# EAGLE design Thermocouple (EAGLE 7.4.0)
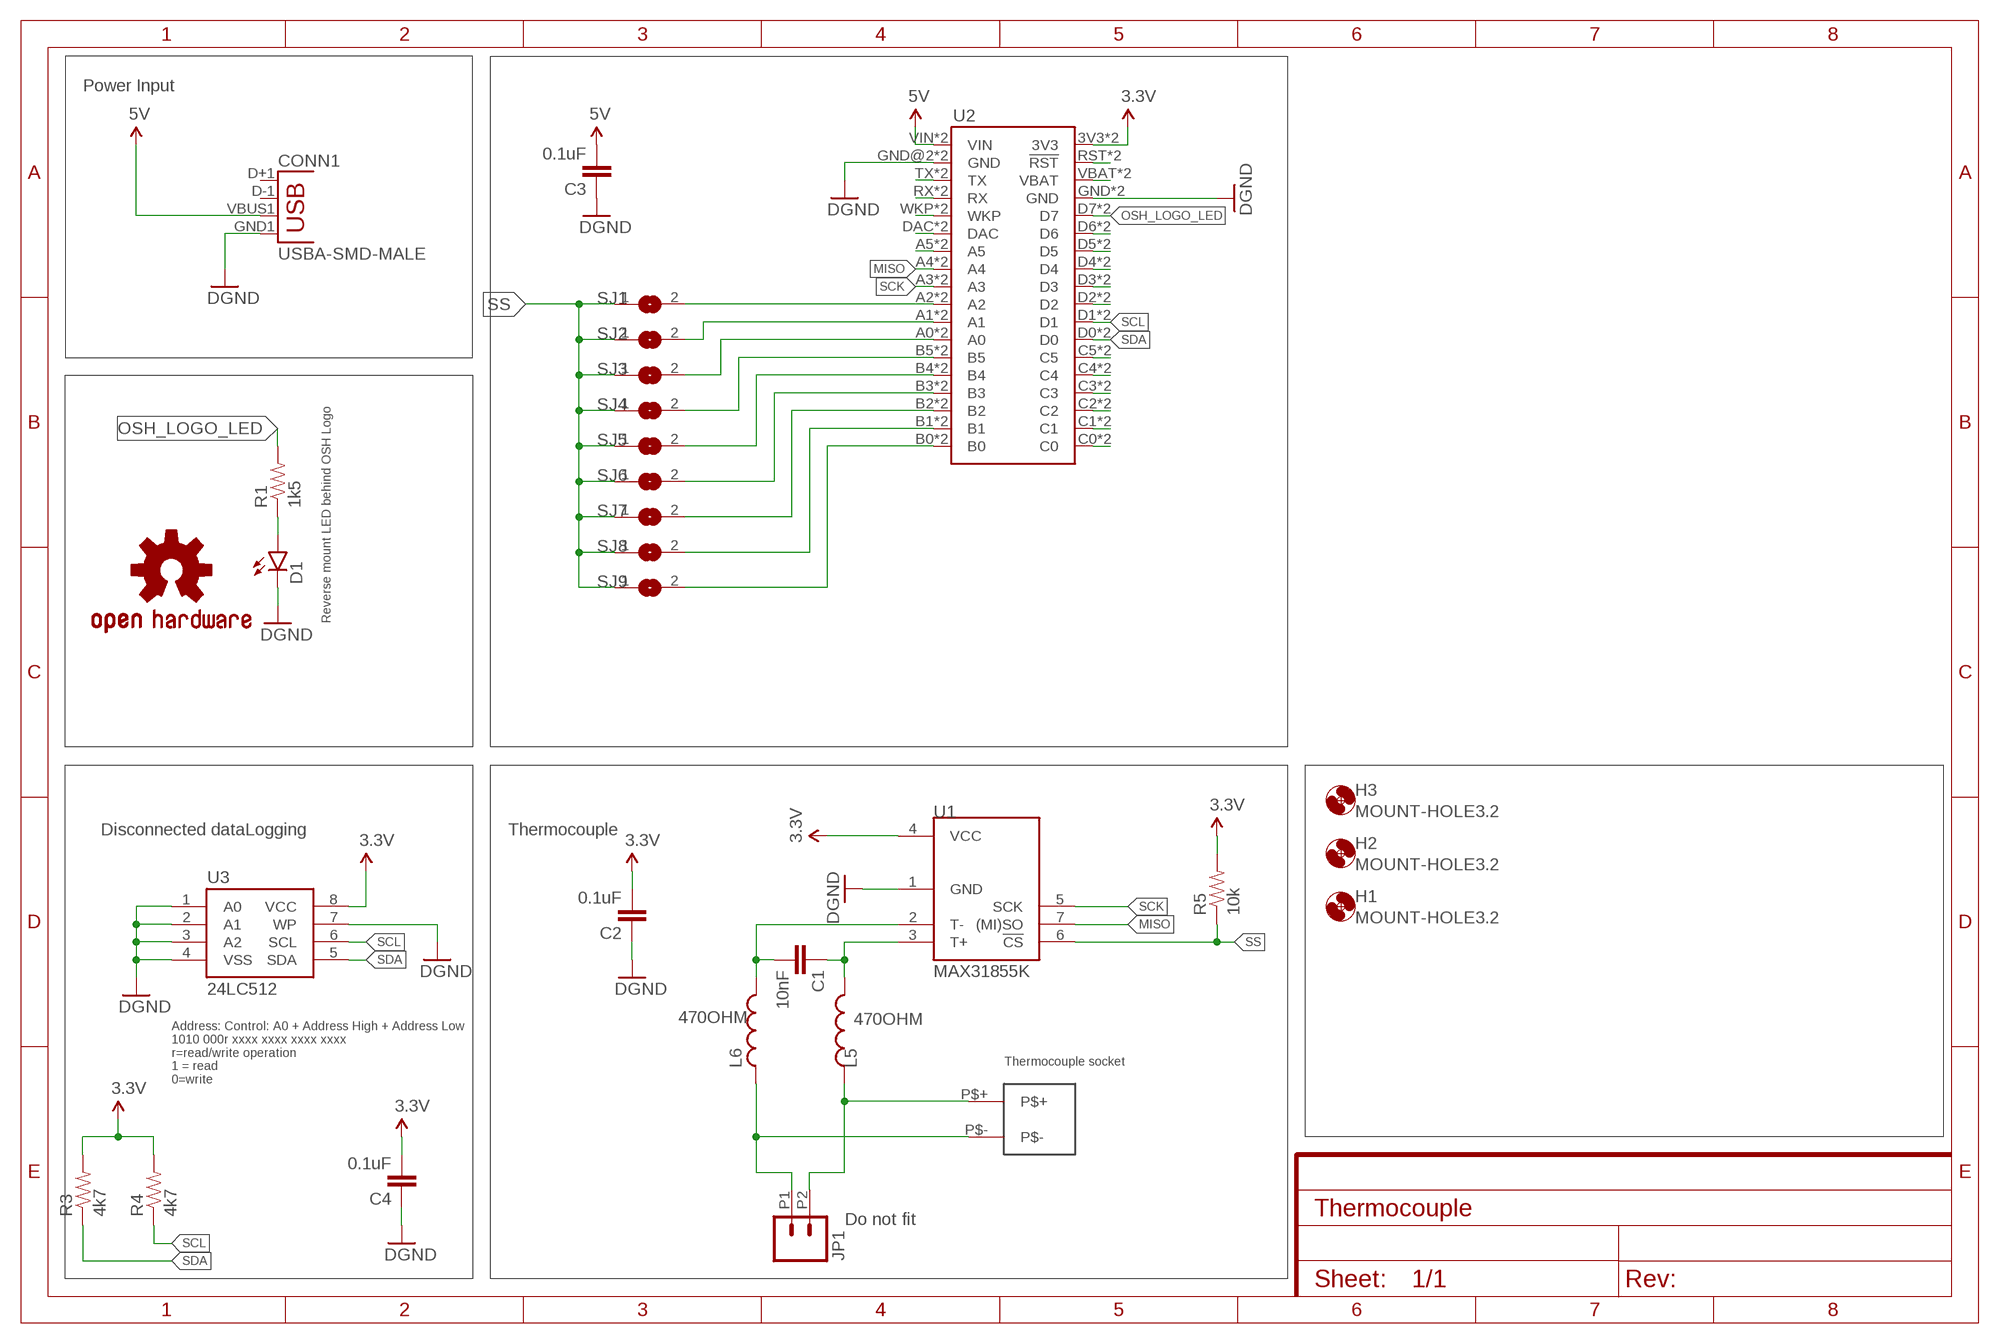
[diagram p0: schematic, sheet 1]

## Parts
C1  10nF  CAP0805  [0805]
C2  0.1uF  CAP0805  [0805]
C3  0.1uF  CAP0805  [0805]
C4  0.1uF  CAP0805  [0805]
CONN1  USBA-SMD-MALE  [USB-A-SMT-MALE]
D1  LED1206-BOTTOM  [LED-1206-BOTTOM]
H1  MOUNT-HOLE3.2  [3,2]
H2  MOUNT-HOLE3.2  [3,2]
H3  MOUNT-HOLE3.2  [3,2]
JP1  M022.54MM_SCREWTERM  [1X02_2.54_SCREWTERM]
JP2  THERMOCOUPLE_SOCKET_K-TYPE  [THERMOCOUPLE_SOCKET_K-TYPE]
L5  470OHM  INDUCTOR0805  [0805]
L6  470OHM  INDUCTOR0805  [0805]
LOGO1  OSHW-LOGOM  [OSHW-LOGO-M]
R1  1k5  RESISTOR1206  [1206]
R3  4k7  RESISTOR0805-RES  [0805]
R4  4k7  RESISTOR0805-RES  [0805]
R5  10k  RESISTOR0805-RES  [0805]
SJ1  SJ  [SJ]
SJ2  SJ  [SJ]
SJ3  SJ  [SJ]
SJ4  SJ  [SJ]
SJ5  SJ  [SJ]
SJ6  SJ  [SJ]
SJ7  SJ  [SJ]
SJ8  SJ  [SJ]
SJ9  SJ  [SJ]
U1  MAX31855K  [SOIC8]
U2  ELECTRONDUALNAMED  [ELECTRON_SIMPLE_SILK_NAMES_DUAL]
U3  24LC512  EEPROM-I2CSMD  [SO08]

## Nets
3.3V: C2.2 C4.2 R3.2 R4.2 R5.2 U1.4(VCC) U2.3V3 U2.3V3_1(3V3) U3.8(VCC)
5V: C3.2 CONN1.VBUS1(VBUS) U2.VIN U2.VIN_1B(VIN)
DQ: SJ3.2 U2.A0 U2.A0_1(A0)
GND: C2.1 C3.1 C4.1 CONN1.GND1(GND) D1.C U1.1(GND) U2.GND U2.GND@2(GND) U2.GND_1(GND) U2.GND_1B(GND) U3.1(A0) U3.2(A1) U3.3(A2) U3.4(VSS) U3.7(WP) ; supply symbol labelled DGND
MISO: U1.7((MI)SO) U2.A4 U2.A4_1(A4)
MOSI: U2.A5 U2.A5_1(A5)
N$3: SJ2.2 U2.A1 U2.A1_1(A1)
N$4: U2.D2 U2.D2_1(D2)
N$6: U2.VBAT U2.VBATT_1(VBAT)
N$7: U2.RST(!RST) U2.RST_1(!RST)
N$11: C1.2 L6.2 U1.2(T-)
N$12: U2.D3 U2.D3_1(D3)
N$13: C1.1 L5.2 U1.3(T+)
N$15: U2.D6 U2.D6_1(D6)
N$16: U2.D5 U2.D5_1(D5)
N$19: JP1.P1 JP2.P$- L6.1
N$20: JP1.P2 JP2.P$+ L5.1
N$21: D1.A R1.1
N$22: U2.C1 U2.C1_1(C1)
N$23: U2.C5 U2.C5_1(C5)
N$24: U2.C4 U2.C4_1(C4)
N$25: U2.C3 U2.C3_1(C3)
N$26: U2.C2 U2.C2_1(C2)
N$27: U2.C0 U2.C0_1(C0)
N$28: U2.D4 U2.D4_1(D4)
N$29: U2.DAC U2.DAC_1(DAC)
N$30: SJ1.2 U2.A2 U2.A2_1(A2)
N$31: SJ9.2 U2.B0 U2.B0_1(B0)
N$33: SJ8.2 U2.B1 U2.B1_1(B1)
N$35: SJ7.2 U2.B2 U2.B2_1(B2)
N$36: SJ6.2 U2.B3 U2.B3_1(B3)
N$37: SJ5.2 U2.B4 U2.B4_1(B4)
N$38: SJ4.2 U2.B5 U2.B5_1(B5)
N$46: U2.WKP U2.WKP_1(WKP)
N$47: U2.RX U2.RX_1(RX)
N$48: U2.TX U2.TX_1(TX)
OSH_LOGO_LED: R1.2 U2.D7 U2.D7_1(D7)
SCK: U1.5(SCK) U2.A3 U2.A3_1(A3)
SCL: R4.1 U2.D1 U2.D1_1(D1) U3.6(SCL)
SDA: R3.1 U2.D0 U2.D0_1(D0) U3.5(SDA)
SS: R5.1 SJ1.1 SJ2.1 SJ3.1 SJ4.1 SJ5.1 SJ6.1 SJ7.1 SJ8.1 SJ9.1 U1.6(!CS)
Unconnected: CONN1.D+1(D+) CONN1.D-1(D-)

## Notes on the sheet
- Power Input
- Reverse mount LED behind OSH Logo
- Disconnected dataLogging | Thermocouple
- Address: Control: A0 + Address High + Address Low
- Thermocouple socket
- 1010 000r xxxx xxxx xxxx xxxx
  r=read/write operation
  1 = read
  0=write
- Do not fit

## Library data of the parts
C1 = SparkFun-Capacitors:CAP: Capacitor Standard 0603 ceramic capacitor, and 0.1" leaded capacitor.
C2-C4 = SparkFun-Passives:CAP: Capacitor Standard 0603 ceramic capacitor, and 0.1" leaded capacitor.
CONN1 = SparkFun-Connectors:USB: USB Connectors USB-B-PTH is fully proven SKU : PRT-00139/CONN-08278 USB-miniB is fully proven SKU : PRT-00587 USB-A-PCB is untested. USB-A-H is throughly reviewed, but untested. Spark Fun Electronics SKU : PRT-00437 USB-B-SMT is throughly reviewed, but untested. Needs silkscreen touching up. USB-A-S has not been used/tested USB-MB-H has not been used/tested USB-MICROB has been used. CONN-09505
D1 = SparkFun-LED:LED: LEDs Standard schematic elements and footprints for 5mm, 3mm, 1206, and 0603 sized LEDs. 5mm - Spark Fun Electronics SKU : COM-00529 (and others)
H1-H3 = holes:MOUNT-HOLE: MOUNTING HOLE with drill center marker
JP1 = SparkFun-Connectors:M02: Standard 2-pin 0.1" header. Use with - straight break away headers ( PRT-00116) - right angle break away headers (PRT-00553) - swiss pins (PRT-00743) - machine pins (PRT-00117) - female headers (PRT-00115) Molex polarized connector foot print use with: PRT-08233 with associated crimp pins and housings. 2.54_SCREWTERM for use with PRT-10571. 3.5mm Screw Terminal footprints for PRT-08084 5mm Screw Terminal footprints for use with PRT-08432
JP2 = Tinamous:THERMOCOUPLE_SOCKET_K-TYPE
L5 L6 = SparkFun-Passives:INDUCTOR: Inductors Basic Inductor/Choke - 0603 and 1206. Footprints are not proven and vary greatly between part numbers. INDUCTOR POWER 3.3UH 4.0A SMD 0.197" L x 0.197" W x 0.177" H (5.00mm x 5.00mm x 4.50mm); FARNELL: 1669726
LOGO1 = SparkFun-Aesthetics:OSHW-LOGO: Open Source Hardware Logo This logo indicates the piece of hardware it is found on incorporates a OSHW license and/or adheres to the definition of open source hardware found here: http://freedomdefined.org/OSHW
R1 R3-R5 = SparkFun-Resistors:RESISTOR: Resistor Basic schematic elements and footprints for 0603, 1206, and PTH resistors.
SJ1-SJ9 = jumper:SJ: SMD solder JUMPER
U1 = SparkFun-AnalogIC:MAX31855K: Cold-Junction-Compensated K-Thermocoupleto-Digital Converter (-270°C to +1800°C) The MAX31855K performs cold-junction compensation and digitizes the signal from a type-K thermocouple. The data is output in a 14-bit resolution, SPI™-compatible, read-only format. This converter resolves temperatures to 0.25°C, allows readings as high as +1800°C and as low as -270°C, and exhibits thermocouple accuracy of ±2°C for temperatures ranging from -200°C to +700°C for K-type thermocouples.
U2 = Tinamous:ELECTRON
U3 = SparkFun-DigitalIC:EEPROM-I2C: I2C EEPROM chips, 24LC256 (and others); FARNELL: 1801220

## Board
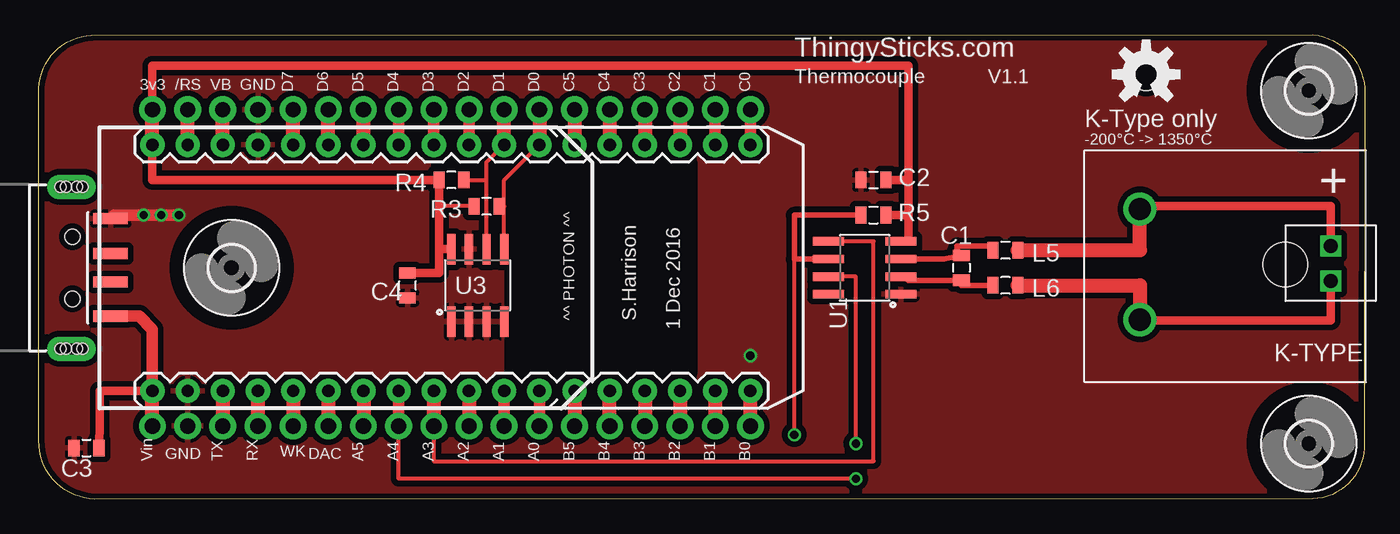
[diagram p1: board, top side]
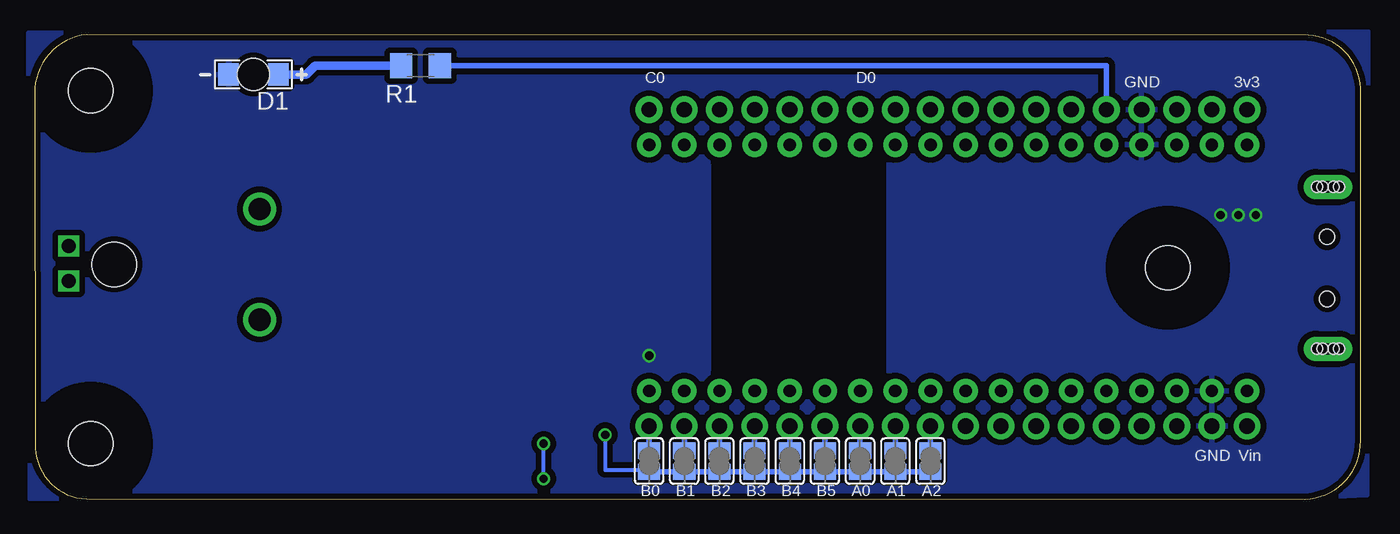
[diagram p2: board, bottom side, seen from below]

Size 95.75 x 33.56 mm. Coordinates in mm from the lower left corner, seen from the top.
Outline: 3.77,33.52 92,33.56 arc-90 95.73,28.91 95.7,4.01 arc-90 92,0.01 4.02,0 arc-90 0,4.21 0,29.31 arc-90 3.77,33.52
Copper layers (1*16): Top 0.0356mm / dielectric 1.5011mm / Bottom 0.0356mm
Design rules "OSHPark": minimum track width 6mil, minimum drill 13mil, track to track 6mil, track to pad 6mil, pad to pad 6mil, via to via 6mil, smd to smd 6mil, copper to edge 15mil, drill to drill 6mil, minimum pad ring 7mil, minimum via ring 7mil, stop-mask expansion 3mil, vias tented up to drill 0mil, thermal gap 10mil
tRestrict: area 34.2,6.5 to 46.9,26.9
bRestrict: area 34.9,6.5 to 46.3,26.9

### Footprints (pad centres in the part's own frame; a part is rotated, then mirrored left to right if it is on the bottom)
0805 = smd 0.8 x 1.2: 1 -0.9,0; 2 0.9,0
USB-A-SMT-MALE = smd 0.8 x 2.5: D+1 1.027,-5.87; D-1 -1.027,-5.87; GND1 3.551,-5.87; VBUS1 -3.5,-5.87 | drill 0.8 pad 1.778 long: P$1 5.85,-3.05; P$3 -5.85,-3.05 | hole 1.1: 2.25,-3.12; -2.25,-3.12 | hole 0.8: -5.85,-3.45; -5.85,-3.85; -5.85,-2.65; -5.85,-2.25; 5.85,-3.45; 5.85,-3.85; 5.85,-2.65; 5.85,-2.25
LED-1206-BOTTOM = smd 1.5 x 1.6: A -1.8,0; C 1.8,0 | hole 2.3: 0,0
3,2 = hole 3.2: 0,0
1X02_2.54_SCREWTERM = drill 1.016 square: P1 2.54,0; P2 0,0
THERMOCOUPLE_SOCKET_K-TYPE = drill 1.6: P$+ 4,12.5; P$- 4,4.5 | hole 3.2: 14.5,8.5
1206 = smd 1.6 x 1.8: 1 -1.4,0; 2 1.4,0
SJ = smd 1.168 x 1.6: 1 -0.762,0; 2 0.762,0
SOIC8 = smd 0.61 x 2.21: 1 -1.905,-2.616; 2 -0.635,-2.616; 3 0.635,-2.616; 4 1.905,-2.616; 5 1.905,2.616; 6 0.635,2.616; 7 -0.635,2.616; 8 -1.905,2.616
ELECTRON_SIMPLE_SILK_NAMES_DUAL = drill 0.889 pad 1.753: 3V3 1.27,22.86; A0 29.21,5.08; A1 26.67,5.08; A2 24.13,5.08; A3 21.59,5.08; A4 19.05,5.08; A5 16.51,5.08; B0 44.45,5.08; B1 41.91,5.08; B2 39.37,5.08; B3 36.83,5.08; B4 34.29,5.08; B5 31.75,5.08; C0 44.45,22.86; C1 41.91,22.86; C2 39.37,22.86; C3 36.83,22.86; C4 34.29,22.86; C5 31.75,22.86; D0 29.21,22.86; D1 26.67,22.86; D2 24.13,22.86; D3 21.59,22.86; D4 19.05,22.86; D5 16.51,22.86; D6 13.97,22.86; D7 11.43,22.86; DAC 13.97,5.08; GND 8.89,22.86; GND@2 3.81,5.08; RST 3.81,22.86; RX 8.89,5.08; TX 6.35,5.08; VBAT 6.35,22.86; VIN 1.27,5.08; WKP 11.43,5.08 | drill 1.1 pad 1.93: 3V3_1 1.27,25.4; A0_1 29.21,2.54; A1_1 26.67,2.54; A2_1 24.13,2.54; A3_1 21.59,2.54; A4_1 19.05,2.54; A5_1 16.51,2.54; B0_1 44.45,2.54; B1_1 41.91,2.54; B2_1 39.37,2.54; B3_1 36.83,2.54; B4_1 34.29,2.54; B5_1 31.75,2.54; C0_1 44.45,25.4; C1_1 41.91,25.4; C2_1 39.37,25.4; C3_1 36.83,25.4; C4_1 34.29,25.4; C5_1 31.75,25.4; D0_1 29.21,25.4; D1_1 26.67,25.4; D2_1 24.13,25.4; D3_1 21.59,25.4; D4_1 19.05,25.4; D5_1 16.51,25.4; D6_1 13.97,25.4; D7_1 11.43,25.4; DAC_1 13.97,2.54; GND_1 8.89,25.4; GND_1B 3.81,2.54; RST_1 3.81,25.4; RX_1 8.89,2.54; TX_1 6.35,2.54; VBATT_1 6.35,25.4; VIN_1B 1.27,2.54; WKP_1 11.43,2.54
SO08 = smd 0.61 x 2.21: 1 -1.905,-2.616; 2 -0.635,-2.616; 3 0.635,-2.616; 4 1.905,-2.616; 5 1.905,2.616; 6 0.635,2.616; 7 -0.635,2.616; 8 -1.905,2.616

### Placement (x,y rotation side)
C1  66.62,16.71 270 top
C2  60.27,23.06 0 top
C3  3.44,3.69 0 top
C4  26.61,15.44 90 top
CONN1  -0.69,16.71 90 top
D1  79.95,30.68 180 bottom
H1  13.91,16.71 0 top
H2  91.7,4.01 0 top
H3  91.7,29.51 0 top
JP1  93.29,18.3 270 top
JP2  75.51,8.46 0 top
L5  69.79,17.98 180 top
L6  69.79,15.44 180 top
LOGO1  79.95,30.68 0 top
R1  67.89,31.31 0 bottom
R3  32.33,21.16 180 top
R4  29.79,23.06 180 top
R5  60.27,20.52 0 top
SJ1  31.06,2.74 90 bottom
SJ2  33.6,2.74 90 bottom
SJ3  36.14,2.74 90 bottom
SJ4  38.68,2.74 90 bottom
SJ5  41.22,2.74 90 bottom
SJ6  43.76,2.74 90 bottom
SJ7  46.3,2.74 90 bottom
SJ8  48.84,2.74 90 bottom
SJ9  51.38,2.74 90 bottom
U1  59.63,16.71 90 top
U2  6.93,2.74 0 top
U3  31.69,15.44 0 top

### Tracks (layer width: path | path; a pad name or v marks a point on that pad's centre or on a via)
3.3V
  Top 0.305: R3.2 28.89,21.16 R4.2
  Top 0.61: U2.3V3 8.2,23.06 R4.2 28.89,18.06 | U3.8 28.89,18.06 | C4.2 28.89,16.34 28.89,18.06 | R5.2 62.81,20.52 | 62.81,20.52 62.81,23.06 | 62.81,23.06 62.81,31.31 8.2,31.31 U2.3V3_1 | C2.2 62.81,23.06 | U1.4 62.81,18.62 62.81,20.52
  Top 1.016: U2.3V3 U2.3V3_1
5V
  Top 0.61: C3.2 4.39,4.96 4.39,7.82 U2.VIN
  Top 0.813: U2.VIN_1B 8.2,12.27 7.25,13.22 CONN1.VBUS1
  Top 1.016: U2.VIN_1B U2.VIN
DQ
  Top 0.813: U2.A0_1 U2.A0
  Bottom 0.406: SJ3.2 U2.A0_1
GND  (via drill 0.6)
  Top 0.813: v10.1,20.52 5.44,20.52 CONN1.GND1
  other vias: 51.38,10.36 7.56,20.52 8.83,20.52
  pour Bottom (isolate 0.406, rank 6): -0.51,33.78 96.18,33.68 96.05,0.03 1.8,0.21 -0.46,0.31
  pour Top (isolate 0.406, rank 6): -0.69,35.12 96.46,34.49 96.78,-0.12 -0.69,0.2
MISO  (via drill 0.6)
  Top 0.305: U1.7 59,16.07 v59,4.01 | v59,1.47 25.98,1.47 U2.A4
  Top 0.813: U2.A4_1 U2.A4
  Bottom 0.305: v59,1.47 v59,4.01
MOSI
  Top 1.016: U2.A5 U2.A5_1
N$3
  Top 0.813: U2.A1_1 U2.A1
  Bottom 0.406: U2.A1_1 SJ2.2
N$4
  Top 0.813: U2.D2_1 U2.D2
N$6
  Top 1.016: U2.VBAT U2.VBATT_1
N$7
  Top 1.016: U2.RST U2.RST_1
N$11
  Top 0.406: L6.2 66.62,15.44 C1.2 62.81,15.81 U1.2
N$12
  Top 0.813: U2.D3_1 U2.D3
N$13
  Top 0.406: L5.2 68.89,18.3 66.3,18.3 66.3,17.98 C1.1 65.35,17.34 U1.3
N$15
  Top 1.016: U2.D6 U2.D6_1
N$16
  Top 1.016: U2.D5 U2.D5_1
N$19
  Top 0.61: JP1.P1 93.29,12.9 79.51,12.9 JP2.P$-
  Top 1.016: L6.1 79.51,15.44 JP2.P$-
N$20
  Top 0.61: JP1.P2 93.29,21.16 79.51,21.16 JP2.P$+
  Top 1.016: L5.1 79.51,17.98 JP2.P$+
N$21
  Bottom 0.61: R1.1 75.51,31.31 76.14,30.68 D1.A
N$22
  Top 0.813: U2.C1_1 U2.C1
N$23
  Top 1.016: U2.C5_1 U2.C5
N$24
  Top 1.016: U2.C4_1 U2.C4
N$25
  Top 1.016: U2.C3_1 U2.C3
N$26
  Top 1.016: U2.C2_1 U2.C2
N$27
  Top 0.813: U2.C0_1 U2.C0
N$28
  Top 0.813: U2.D4_1 U2.D4
N$29
  Top 1.016: U2.DAC U2.DAC_1
N$30
  Top 1.016: U2.A2 U2.A2_1
  Bottom 0.406: U2.A2_1 SJ1.2
N$31
  Top 1.016: U2.B0_1 U2.B0
  Bottom 0.406: SJ9.2 U2.B0_1
N$33
  Top 1.016: U2.B1 U2.B1_1
  Bottom 0.406: U2.B1_1 SJ8.2
N$35
  Top 1.016: U2.B2 U2.B2_1
  Bottom 0.406: SJ7.2 U2.B2_1
N$36
  Top 1.016: U2.B3 U2.B3_1
  Bottom 0.406: SJ6.2 U2.B3_1
N$37
  Top 1.016: U2.B4_1 U2.B4
  Bottom 0.406: SJ5.2 U2.B4_1
N$38
  Top 1.016: U2.B5 U2.B5_1
  Bottom 0.406: SJ4.2 U2.B5_1
N$46
  Top 1.016: U2.WKP U2.WKP_1
N$47
  Top 1.016: U2.RX_1 U2.RX
N$48
  Top 1.016: U2.TX U2.TX_1
OSH_LOGO_LED
  Top 1.016: U2.D7 U2.D7_1
  Bottom 0.406: R1.2 65.35,31.31 18.36,31.31 U2.D7_1
SCK
  Top 0.305: U2.A3 28.52,2.74 60.27,2.74 60.27,18.62 U1.5
  Top 1.016: U2.A3 U2.A3_1
SCL
  Top 0.305: 32.33,18.62 32.33,23.06 | R4.1 32.33,23.06 | 32.33,23.06 32.33,24.33 U2.D1
  Top 0.406: U3.6 32.33,18.62
  Top 1.016: U2.D1 U2.D1_1
SDA
  Top 0.305: U3.5 33.6,21.16 | 33.6,21.16 33.6,23.06 U2.D0 | R3.1 33.6,21.16
  Top 1.016: U2.D0_1 U2.D0
SS  (via drill 0.6)
  Top 0.305: v54.55,4.64 54.55,17.34
  Top 0.406: U1.6 54.55,17.34 54.55,20.52 R5.1
  Bottom 0.305: v54.55,4.64 54.55,2.1 51.38,2.1 SJ9.1
  Bottom 0.406: SJ1.1 SJ2.1 SJ3.1 SJ4.1 SJ5.1 SJ6.1 SJ7.1 SJ8.1 | SJ8.1 SJ9.1 | SJ8.1 48.84,2.1

### Text on the board
tNames: ThingySticks.com | Thermocouple | V1.1 | K-Type only | -200°C -> 1350°C | ^^ PHOTON ^^ | S.Harrison | 1 Dec 2016
bNames: 3v3 | GND | D0 | C0 | Vin | GND | A2 | A1 | A0 | B5 | B4 | B3 | B2 | B1 | B0